# EasyEDA Pro project ProProject_Yuzuki Chameleon_2023-09-02.epro, board 树莓派A版形状
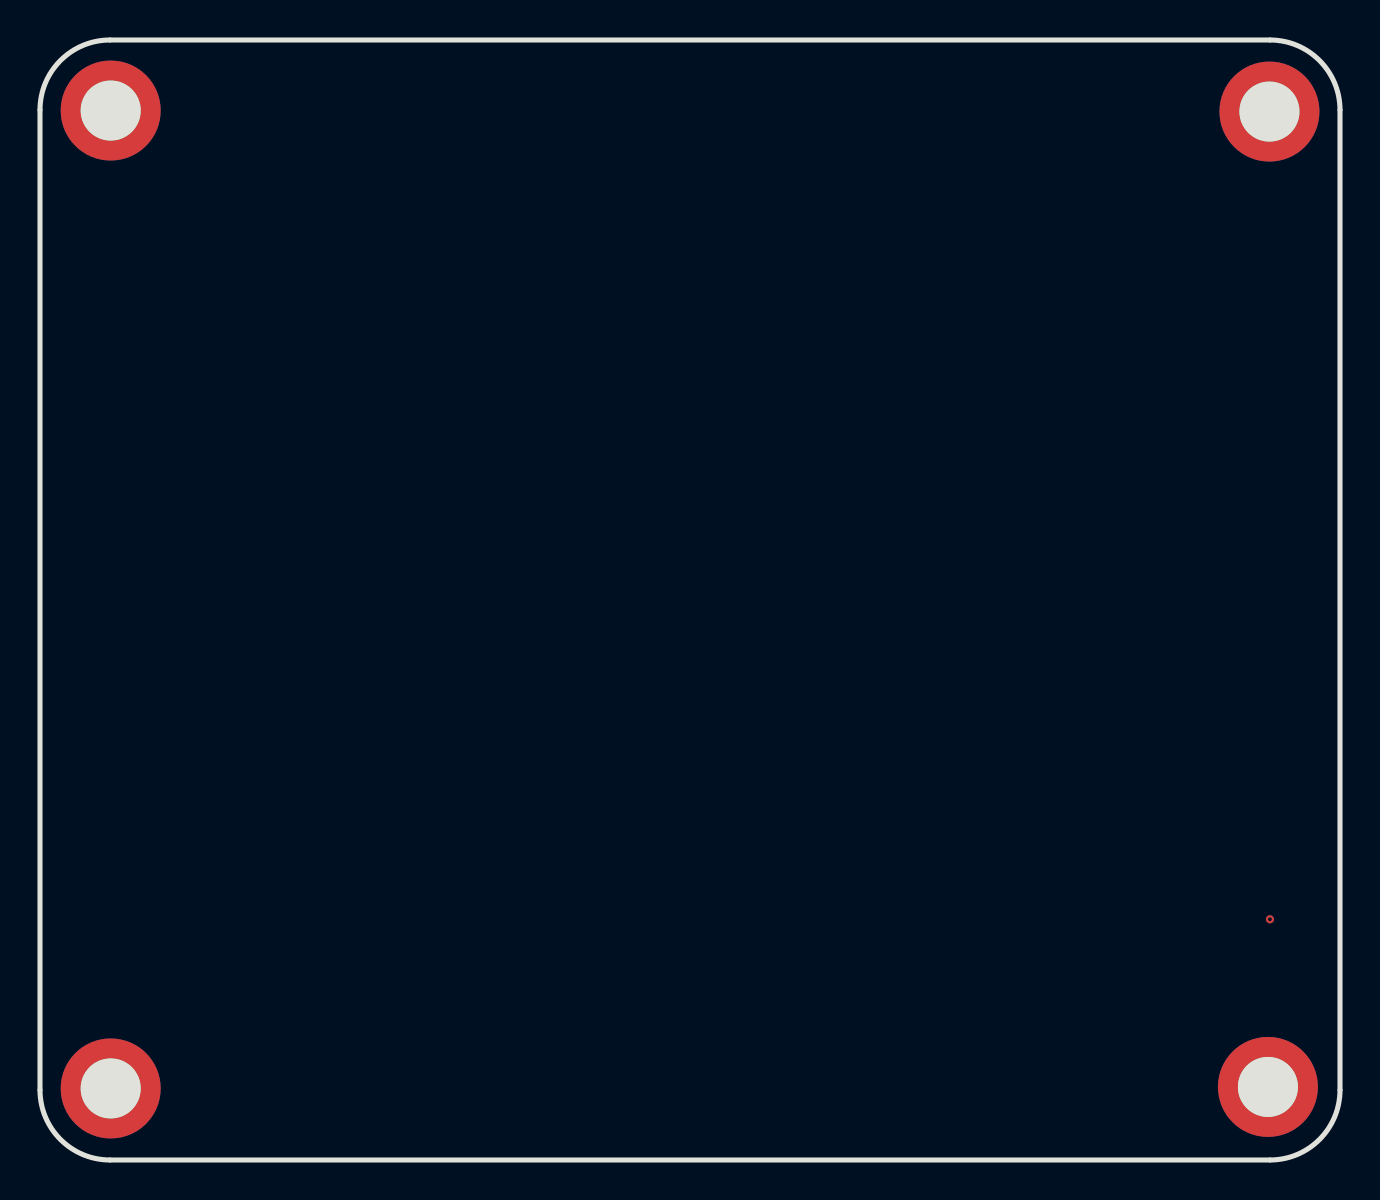
[diagram p10: board, top side]
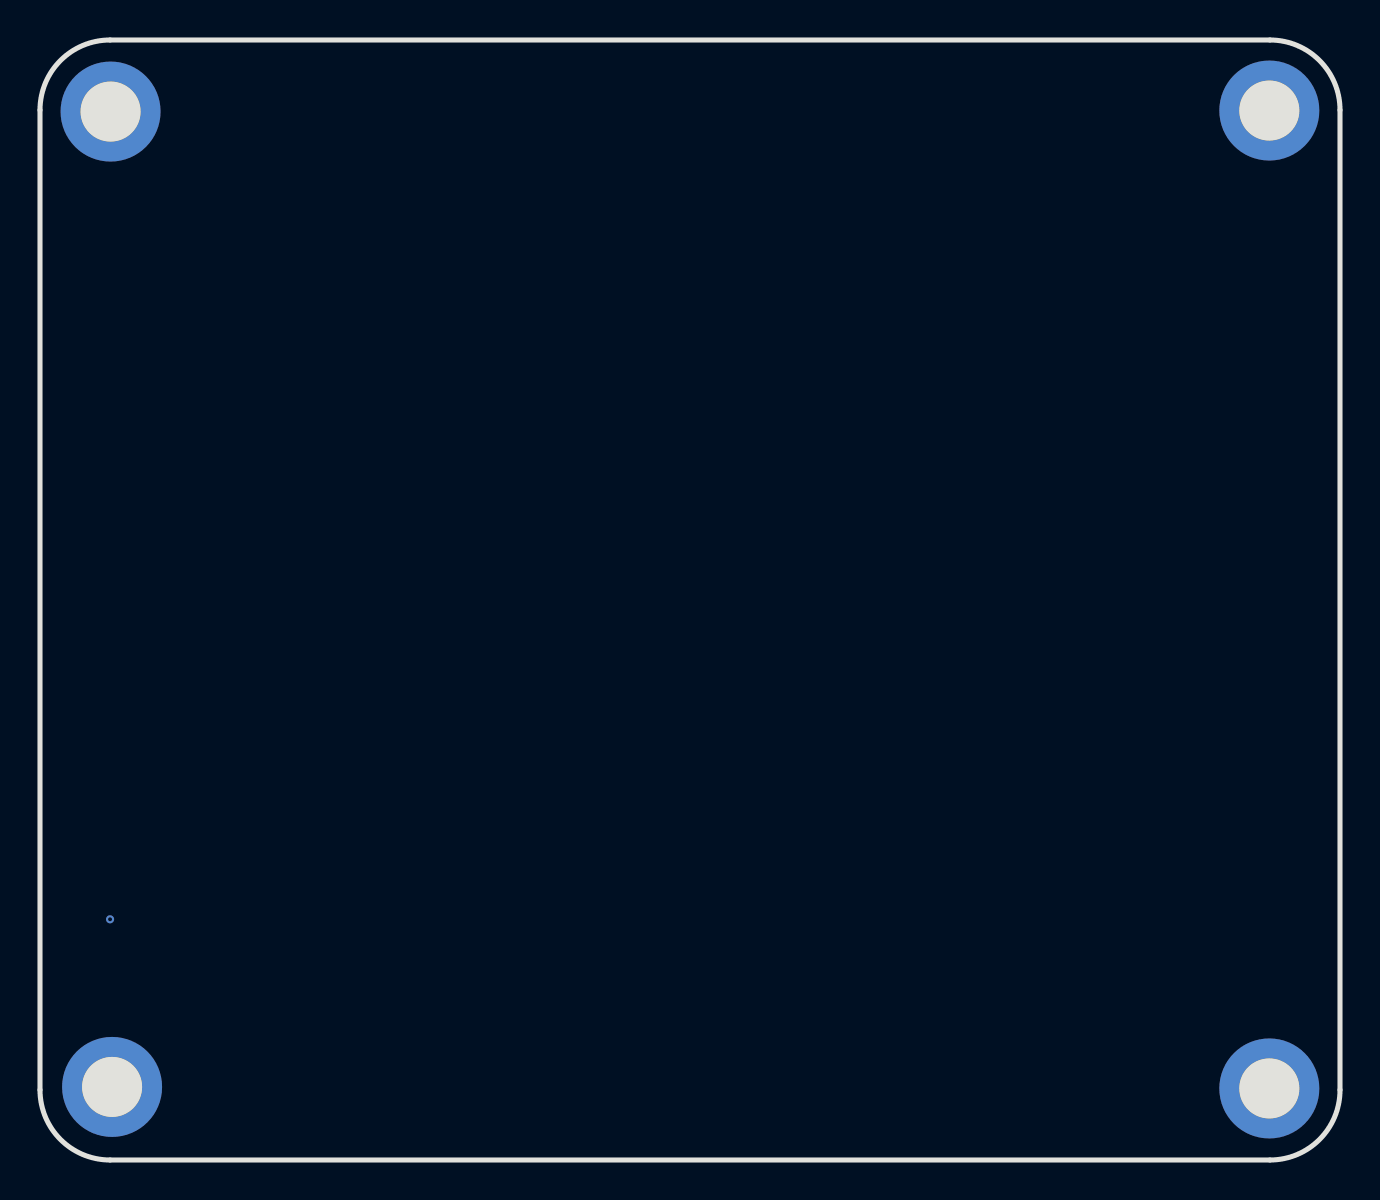
[diagram p11: board, bottom side, seen from below]

Outline 65 x 56 mm; copper layers: Top Layer, Inner1, Inner2, Bottom Layer. Coordinates in mm from the lower left corner of the outline.
Outline path: 0,52.5 0,3.5 arc(1.03,1.03) 3.5,0 61.5,0 arc(63.97,1.03) 65,3.5 65,52.5 arc(63.97,54.97) 61.5,56 3.5,56 arc(1.03,54.97) 0,52.5
Stack: Top Layer 0.035mm / Dielectric1 0.48mm PP er 4.5 / Inner1 0.035mm / Dielectric2 0.48mm FR4 er 4.5 / Inner2 0.035mm / Dielectric3 0.48mm PP er 4.5 / Bottom Layer 0.035mm

## Design rules (mm)
spacing safeClearance (default): track to track 0.102, other pairs 0.089 to 0.3
track width trackWidth (default): min 0.102, default 0.152, max 2.54
differential pair differentialPair (default): width min 0.127, default 0.254, max 2.54; gap min 0.152, default 0.152
via viaSize (default): diameter min 0.406, default 0.406, max 10; hole min 0.201, default 0.201, max 5.999

## Placement (name value [footprint] x y rotation side)
NOREF  -  [Pad_e8]  3.53 3.58 0 top
NOREF#2  -  [Pad_e10]  61.47 52.42 0 top
NOREF#3  -  [Pad_e2]  3.53 52.47 0 top
NOREF#4  -  [Pad_e9]  61.4 3.65 0 top

## Footprints (pads in the part's own frame, mm; a bottom-side part is the same pattern mirrored in y, then rotated)
Pad_e2
  round 5 hole 3: 1(0,0)
Pad_e8
  round 5 hole 3: 1(0,0)
Pad_e9
  round 5 hole 3: 1(0,0)
Pad_e10
  round 5 hole 3: 1(0,0)

## Nets
GND: NOREF.1 NOREF#2.1 NOREF#3.1 NOREF#4.1

## Via types
v1: diameter 0.406, hole 0.201, Top Layer to Bottom Layer, 1 via

## Routing (per net, layer and track width the routed paths; a pad name or vN(x,y) marks a point on that pad's centre or on a via; arc(x,y) is an arc through that point)
3V3:
  vias: v1(61.5,12.04)
